# EAGLE schematic MotherBoard (EAGLE 6.4)
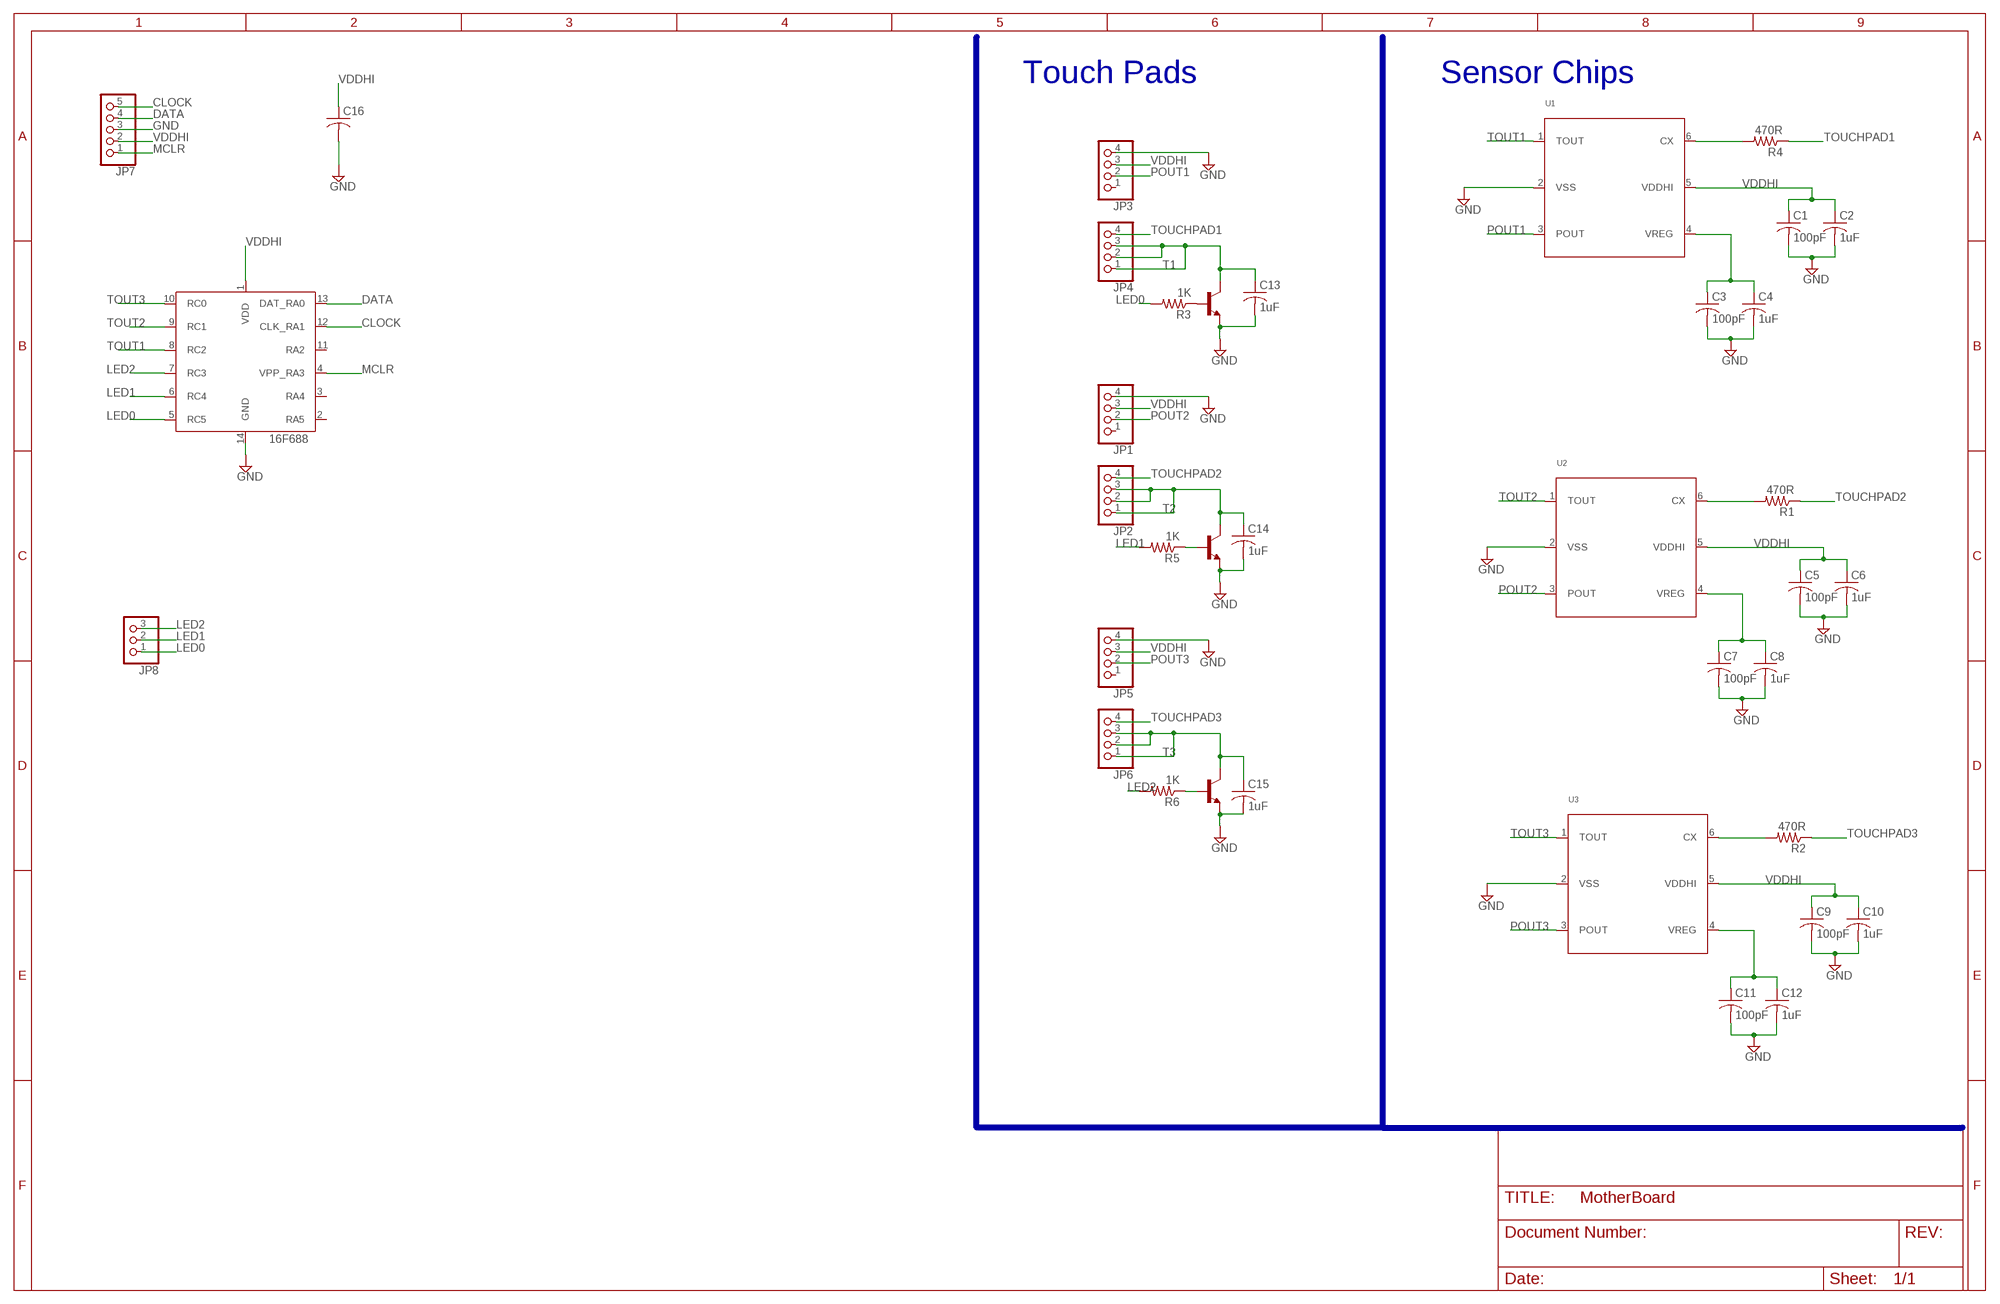
[diagram p0: schematic, sheet 1]

## Parts
C1  100pF  C-USC0603K  [C0603K]
C2  1uF  C-USC0603K  [C0603K]
C3  100pF  C-USC0603K  [C0603K]
C4  1uF  C-USC0603K  [C0603K]
C5  100pF  C-USC0603K  [C0603K]
C6  1uF  C-USC0603K  [C0603K]
C7  100pF  C-USC0603K  [C0603K]
C8  1uF  C-USC0603K  [C0603K]
C9  100pF  C-USC0603K  [C0603K]
C10  1uF  C-USC0603K  [C0603K]
C11  100pF  C-USC0603K  [C0603K]
C12  1uF  C-USC0603K  [C0603K]
C13  1uF  C-USC0603K  [C0603K]
C14  1uF  C-USC0603K  [C0603K]
C15  1uF  C-USC0603K  [C0603K]
C16  C-USC1206  [C1206]
JP1  PINHD-1X4  [1X04]
JP2  PINHD-1X4  [1X04]
JP3  PINHD-1X4  [1X04]
JP4  PINHD-1X4  [1X04]
JP5  PINHD-1X4  [1X04]
JP6  PINHD-1X4  [1X04]
JP7  PINHD-1X5  [1X05]
JP8  PINHD-1X3  [1X03]
R1  470R  R-US_R0603  [R0603]
R2  470R  R-US_R0603  [R0603]
R3  1K  R-US_R0603  [R0603]
R4  470R  R-US_R0603  [R0603]
R5  1K  R-US_R0603  [R0603]
R6  1K  R-US_R0603  [R0603]
T1  BC818-NPN-SOT23-BEC  [SOT23-BEC]
T2  BC818-NPN-SOT23-BEC  [SOT23-BEC]
T3  BC818-NPN-SOT23-BEC  [SOT23-BEC]
U1  IQS127  [SOT23-6]
U2  IQS127  [SOT23-6]
U3  IQS127  [SOT23-6]
U$1  PIC16F688SOIC14  [SOIC14]

## Nets
CLOCK: JP7.5 U$1.12(CLK_RA1)
DATA: JP7.4 U$1.13(DAT_RA0)
GND: C1.2 C2.2 C3.2 C4.2 C5.2 C6.2 C7.2 C8.2 C9.2 C10.2 C11.2 C12.2 C13.2 C14.2 C15.2 C16.2 JP1.4 JP3.4 JP5.4 JP7.3 T1.E T2.E T3.E U1.2(VSS) U2.2(VSS) U3.2(VSS) U$1.14(GND)
LED0: JP8.1 R3.2 U$1.5(RC5)
LED1: JP8.2 R5.2 U$1.6(RC4)
LED2: JP8.3 R6.2 U$1.7(RC3)
MCLR: JP7.1 U$1.4(VPP_RA3)
N$1: C7.1 C8.1 U2.4(VREG)
N$2: R1.2 U2.6(CX)
N$3: C3.1 C4.1 U1.4(VREG)
N$4: C13.1 JP4.1 JP4.2 JP4.3 T1.C
N$5: C14.1 JP2.1 JP2.2 JP2.3 T2.C
N$6: C15.1 JP6.1 JP6.2 JP6.3 T3.C
N$7: C11.1 C12.1 U3.4(VREG)
N$8: R4.2 U1.6(CX)
N$9: R3.1 T1.B
N$10: R5.1 T2.B
N$11: R6.1 T3.B
N$12: R2.2 U3.6(CX)
POUT1: JP3.2 U1.3(POUT)
POUT2: JP1.2 U2.3(POUT)
POUT3: JP5.2 U3.3(POUT)
TOUCHPAD1: JP4.4 R4.1
TOUCHPAD2: JP2.4 R1.1
TOUCHPAD3: JP6.4 R2.1
TOUT1: U1.1(TOUT) U$1.8(RC2)
TOUT2: U2.1(TOUT) U$1.9(RC1)
TOUT3: U3.1(TOUT) U$1.10(RC0)
VDDHI: C1.1 C2.1 C5.1 C6.1 C9.1 C10.1 C16.1 JP1.3 JP3.3 JP5.3 JP7.2 U1.5(VDDHI) U2.5(VDDHI) U3.5(VDDHI) U$1.1(VDD)
Unconnected: JP1.1 JP3.1 JP5.1 U$1.2(RA5) U$1.3(RA4) U$1.11(RA2)

## Buses
B$1

## Notes on the sheet
- Touch Pads | Sensor Chips

## Library data of the parts
C1-C16 = adafruit:C-US: CAPACITOR, American symbol
JP1-JP6 = pinhead:PINHD-1X4: PIN HEADER
JP7 = pinhead:PINHD-1X5: PIN HEADER
JP8 = pinhead:PINHD-1X3: PIN HEADER
R1-R6 = adafruit:R-US_: RESISTOR, American symbol
T1-T3 = transistor:*-NPN-: NPN Transistror BF959 corrected 2008.03.06
U1-U3 = soulysolar:IQS127: IQS-127 Capacitive Touch Sensor Operating temperature - 40°C to 85°C Supply Voltage (VDDHI–VSS) 2.95 - 5V Mouser: 957-IQS127D00000TSR
U$1 = microchip-16f688:PIC16F688